# EAGLE design asomator4 (EAGLE 7.7.0)
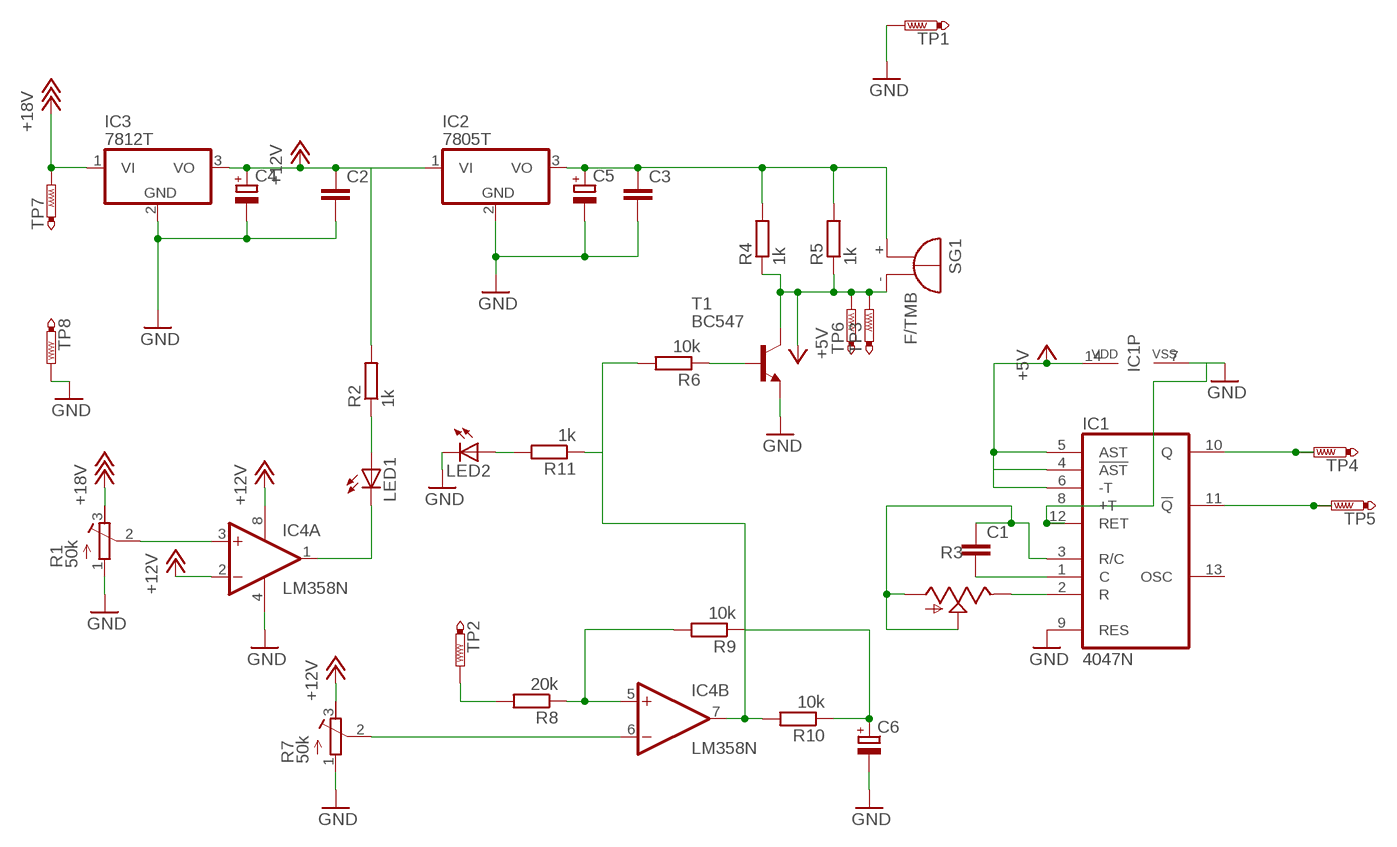
[diagram p0: schematic, sheet 1]

## Parts
C1  C-EU025-030X050  [C025-030X050]
C2  C-EU025-030X050  [C025-030X050]
C3  C-EU025-030X050  [C025-030X050]
C4  CPOL-EUE2.5-6  [E2,5-6]
C5  CPOL-EUE2.5-6  [E2,5-6]
C6  CPOL-EUE2.5-6  [E2,5-6]
IC1  4047N  [DIL14]
IC2  7805T  [TO220H]
IC3  7812T  [TO220H]
IC4  LM358N  [DIL08]
LED1  LED5MM  [LED5MM]
LED2  LED5MM  [LED5MM]
R1  50k  R-TRIMM64W  [RTRIM64W]
R2  1k  R-EU_0207/10  [0207/10]
R3  TRIM_US-CA9V  [CA9V]
R4  1k  R-EU_0207/10  [0207/10]
R5  1k  R-EU_0207/10  [0207/10]
R6  10k  R-EU_0207/10  [0207/10]
R7  50k  R-TRIMM64W  [RTRIM64W]
R8  20k  R-EU_0207/10  [0207/10]
R9  10k  R-EU_0207/10  [0207/10]
R10  10k  R-EU_0207/10  [0207/10]
R11  1k  R-EU_0207/10  [0207/10]
SG1  F/TMB  [F/TMB]
T1  BC547  [TO92]
TP1  PTR1PAD1-13Y  [P1-13Y]
TP2  PTR1PAD1-13Y  [P1-13Y]
TP3  PTR1PAD1-13Y  [P1-13Y]
TP4  PTR1PAD1-13Y  [P1-13Y]
TP5  PTR1PAD1-13Y  [P1-13Y]
TP6  PTR1PAD1-13Y  [P1-13Y]
TP7  PTR1PAD1-13Y  [P1-13Y]
TP8  PTR1PAD1-13Y  [P1-13Y]

## Nets
+5V: IC1.4(!AST) IC1.5(AST) IC1.6(-T) IC1.14(VDD) R4.1 R5.1 SG1.- T1.3(C) TP3.TP TP6.TP
+12V: C2.1 C4.+ IC2.1(VI) IC3.3(VO) IC4.2(A:-IN) IC4.8(P:V+) R2.2 R7.3(E)
+18V: IC3.1(VI) R1.3(E) TP7.TP
GND: C2.2 C3.2 C4.- C5.- C6.- IC1.7(VSS) IC1.8(+T) IC1.9(RES) IC1.12(RET) IC2.2(GND) IC3.2(GND) IC4.4(P:V-) LED2.K(C) R1.1(A) R7.1(A) T1.1(E) TP1.TP TP8.TP
N$1: IC1.10(Q) TP4.TP
N$2: LED1.A R2.1
N$3: IC1.11(!Q) TP5.TP
N$4: IC4.1(A:OUT) LED1.K(C)
N$5: IC4.3(A:+IN) R1.2(S)
N$6: IC4.7(B:OUT) R6.2 R10.2 R11.1
N$7: IC1.2(R) R3.E
N$8: C1.2 IC1.1(C)
N$9: C1.1 IC1.3(R/C) R3.A R3.S
N$10: C3.1 C5.+ IC2.3(VO) R4.2 R5.2 SG1.+
N$11: LED2.A R11.2
N$12: R8.2 TP2.TP
N$13: IC4.5(B:+IN) R8.1 R9.2
N$14: C6.+ R9.1 R10.1
N$15: IC4.6(B:-IN) R7.2(S)
N$18: R6.1 T1.2(B)
Unconnected: IC1.13(OSC)

## Library data of the parts
C1-C3 = rcl:C-EU: CAPACITOR, European symbol
C4-C6 = rcl:CPOL-EU: POLARIZED CAPACITOR, European symbol
IC1 = 40xx:4047: LP monostable/astable MULTIVIBRATOR
IC2 IC3 = linear:78*: Positive VOLTAGE REGULATOR Source: http://cache.national.com/ds/LM/LM78L05.pdf http://www.fairchildsemi.com/ds/LM/LM7805.pdf
IC4 = linear:LM358: OP AMP also LM158; LM258; LM2904 Source: http://cache.national.com/ds/LM/LM158.pdf
LED1 LED2 = led:LED: LED OSRAM: - CHIPLED LG R971, LG N971, LY N971, LG Q971, LY Q971, LO R971, LY R971 LH N974, LH R974 LS Q976, LO Q976, LY Q976 LO Q996 - Hyper CHIPLED LW Q18S LB Q993, LB Q99A, LB R99A - SideLED LS A670, LO A670, LY A670, LG A670, LP A670 LB A673, LV A673, LT A673, LW A673 LH A674 LY A675 LS A676, LA A676, LO A676, LY A676, LW A676 LS A679, LY A679, LG A679 - Hyper Micro SIDELED® LS Y876, LA Y876, LO Y876, LY Y876 LT Y87S - SmartLED LW L88C, LW L88S LB L89C, LB L89S, LG L890 LS L89K, LO L89K, LY L89K LS L896, LA L896, LO L896, LY L896 - TOPLED LS T670, LO T670, LY T670, LG T670, LP T670 LSG T670, LSP T670, LSY T670, LOP T670, LYG T670 LG T671, LOG T671, LSG T671 LB T673, LV T673, LT T673, LW T673 LH T674 LS T676, LA T676, LO T676, LY T676, LB T676, LH T676, LSB T676, LW T676 LB T67C, LV T67C, LT T67C, LS T67K, LO T67K, LY T67K, LW E67C LS E67B, LA E67B, LO E67B, LY E67B, LB E67C, LV E67C, LT E67C LW T67C LS T679, LY T679, LG T679 LS T770, LO T770, LY T770, LG T770, LP T770 LB T773, LV T773, LT T773, LW T773 LH T774 LS E675, LA E675, LY E675, LS T675 LS T776, LA T776, LO T776, LY T776, LB T776 LHGB T686 LT T68C, LB T68C - Hyper Mini TOPLED® LB M676 - Mini TOPLED Santana® LG M470 LS M47K, LO M47K, LY M47K Source: http://www.osram.convergy.de LUXEON: - LUMILED® LXK2-PW12-R00, LXK2-PW12-S00, LXK2-PW14-U00, LXK2-PW14-V00 LXK2-PM12-R00, LXK2-PM12-S00, LXK2-PM14-U00 LXK2-PE12-Q00, LXK2-PE12-R00, LXK2-PE12-S00, LXK2-PE14-T00, LXK2-PE14-U00 LXK2-PB12-K00, LXK2-PB12-L00, LXK2-PB12-M00, LXK2-PB14-N00, LXK2-PB14-P00, LXK2-PB14-Q00 LXK2-PR12-L00, LXK2-PR12-M00, LXK2-PR14-Q00, LXK2-PR14-R00 LXK2-PD12-Q00, LXK2-PD12-R00, LXK2-PD12-S00 LXK2-PH12-R00, LXK2-PH12-S00 LXK2-PL12-P00, LXK2-PL12-Q00, LXK2-PL12-R00 Source: www.luxeon.com KINGBRIGHT: KA-3528ASYC Source: www.kingbright.com
R1 R7 = rcl:R-TRIMM: Trimm resistor
R2 R4-R6 R8-R11 = rcl:R-EU_: RESISTOR, European symbol
R3 = pot:TRIM_US-: POTENTIOMETER
SG1 = buzzer:F/TMB: BUZZER Source: Buerklin; OC_FARNELL: unknown; OC_NEWARK: unknown
T1 = transistor:BC547: NPN TRANSISTOR
TP1-TP8 = testpad:PTR1: TEST PIN

## Board
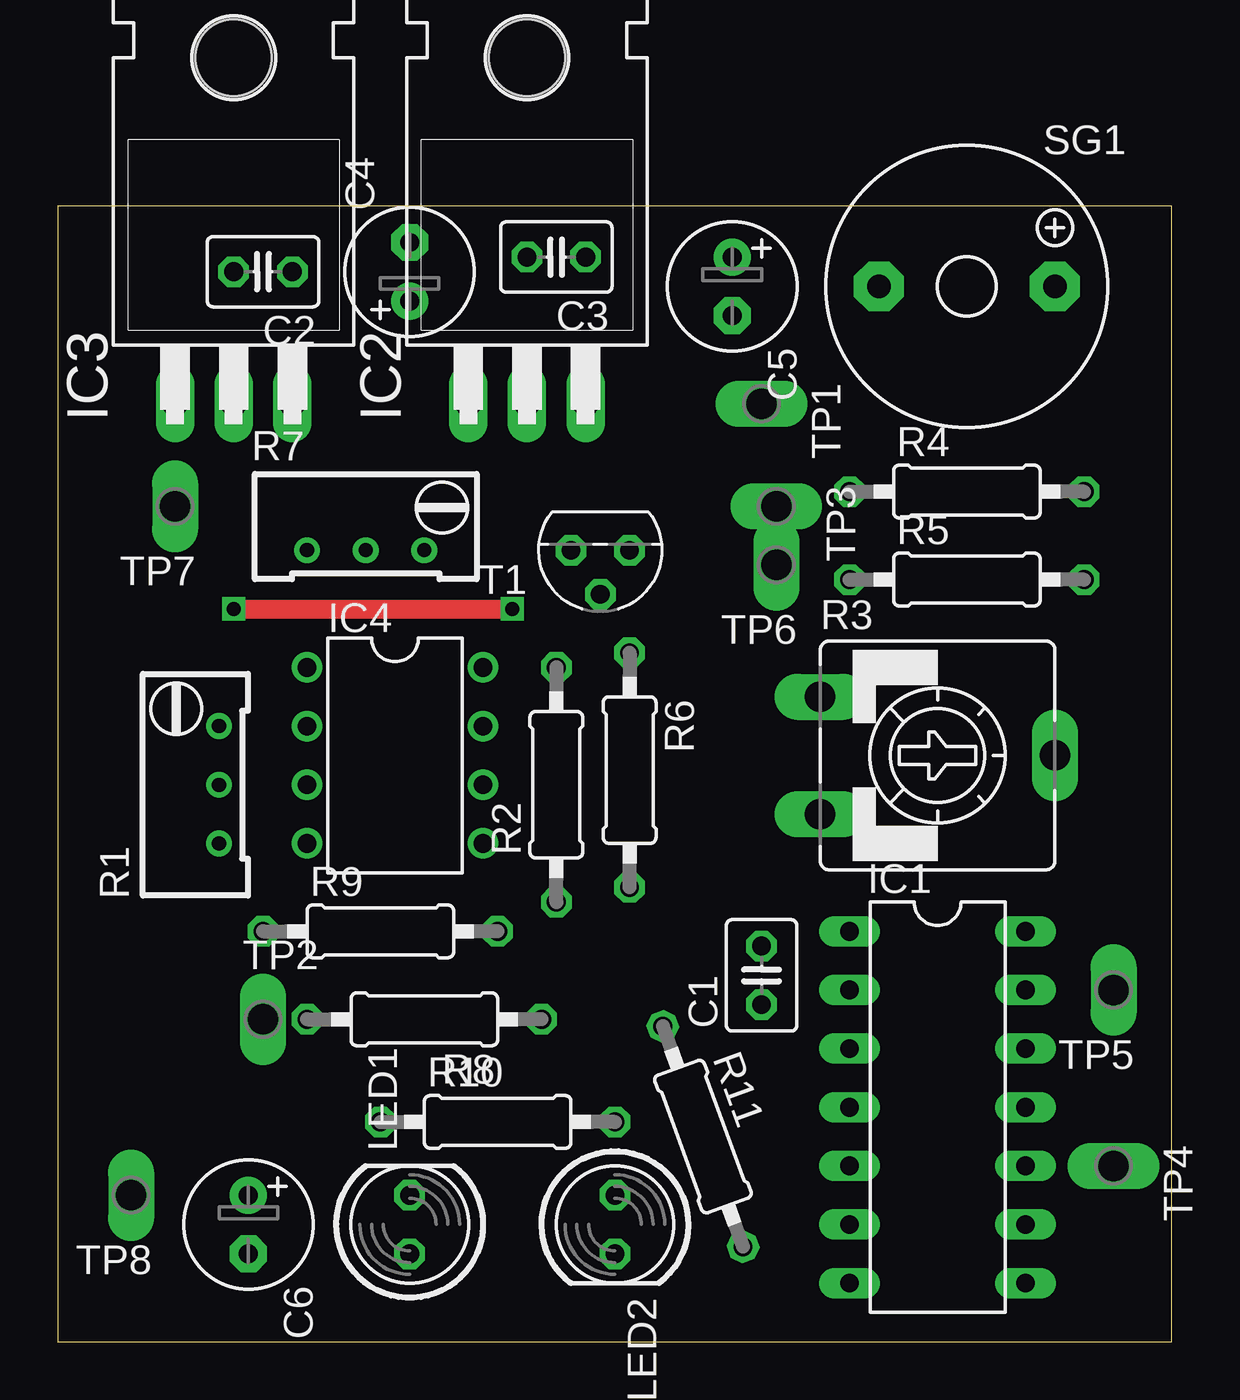
[diagram p1: board, top side]
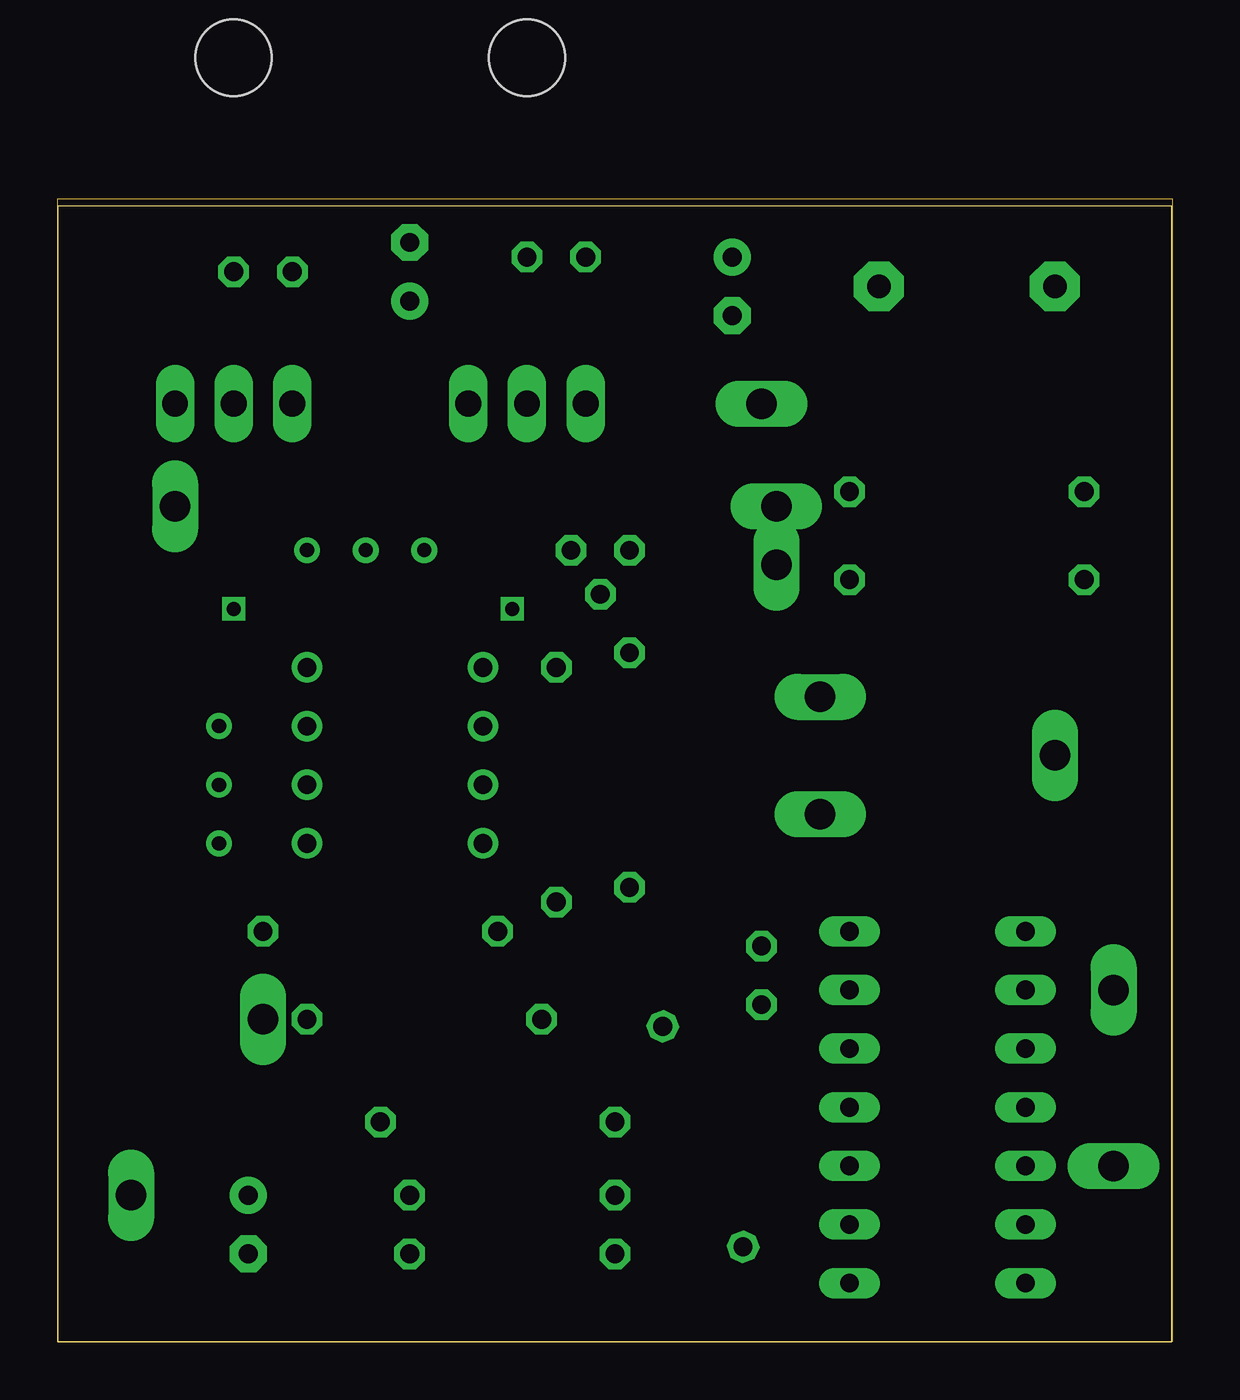
[diagram p2: board, inner layer Route2]
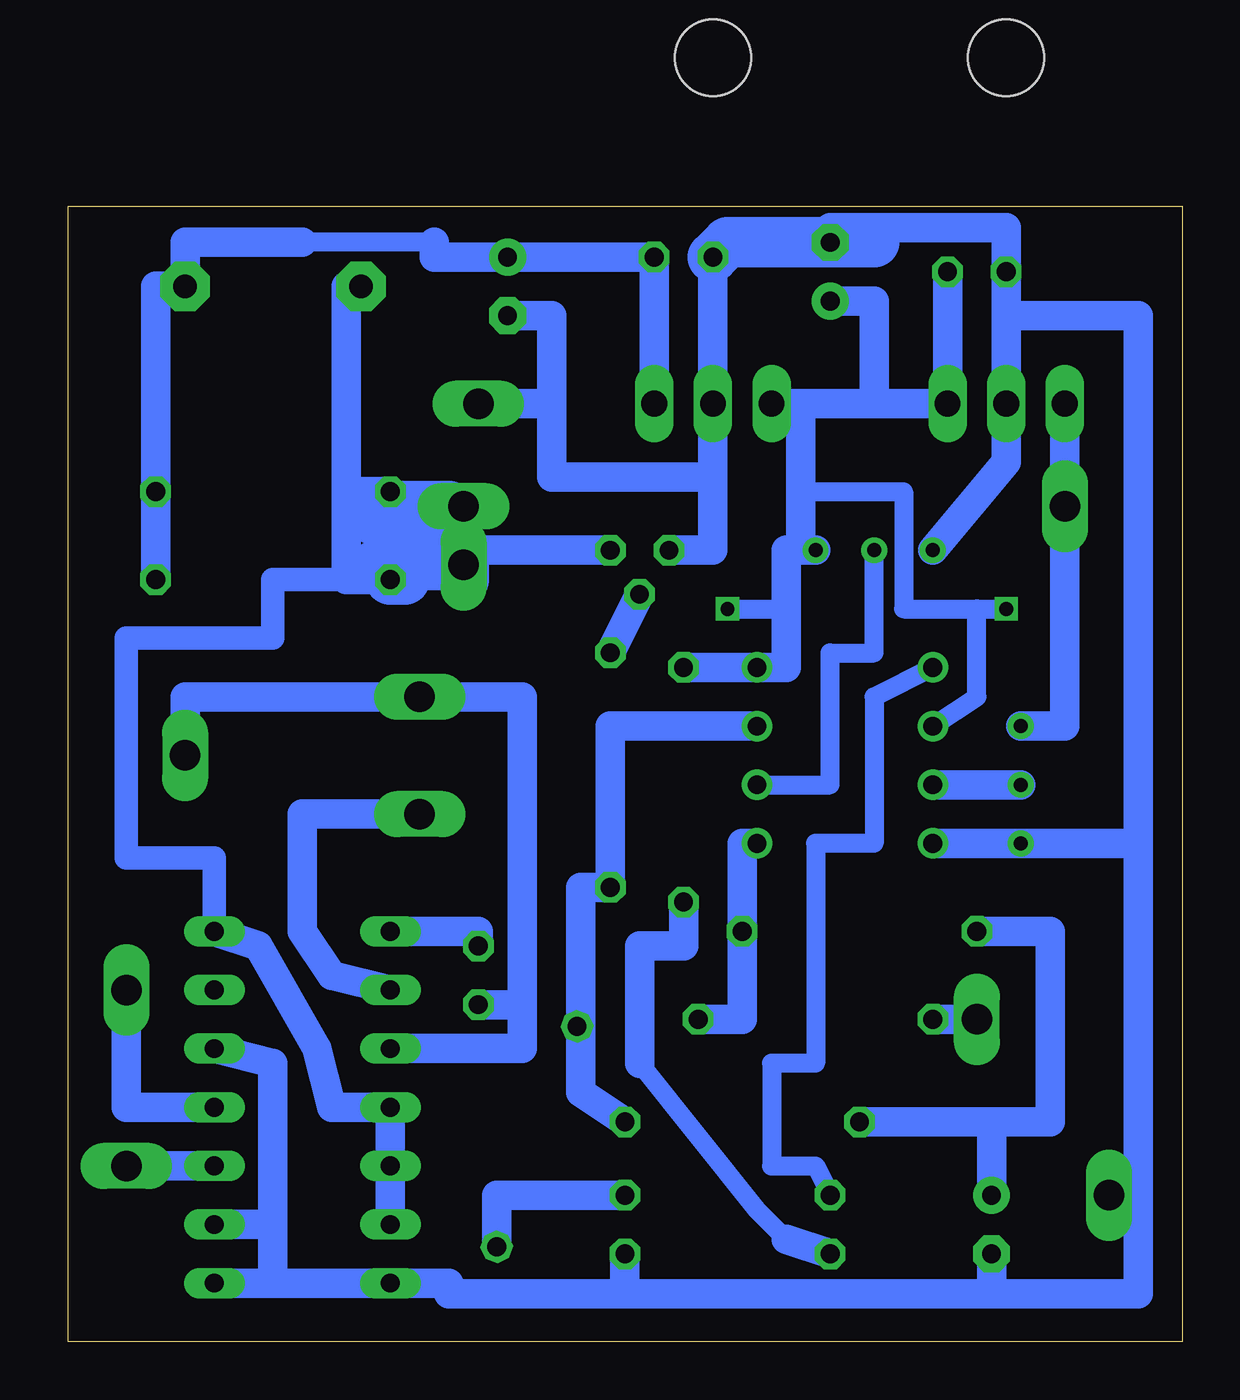
[diagram p3: board, bottom side, seen from below]

Size 48.24 x 49.2 mm. Coordinates in mm from the lower left corner, seen from the top.
Outline: 0,0 48.24,0 48.24,49.2 0,49.2 0,0
Copper layers (1*2*16): Top 0.035mm / dielectric 1.5mm / Route2 0.035mm / dielectric 0.15mm / Bottom 0.035mm
Design rules "default *": minimum track width 32mil, minimum drill 24mil, track to track 8mil, track to pad 8mil, pad to pad 8mil, via to via 8mil, smd to smd 8mil, copper to edge 40mil, drill to drill 8mil, minimum pad ring 10mil, minimum via ring 8mil, stop-mask expansion 4mil, vias tented up to drill 0mil, thermal gap 10mil

### Footprints (pad centres in the part's own frame; a part is rotated, then mirrored left to right if it is on the bottom)
C025-030X050 = drill 0.813 octagon: 1 -1.27,0; 2 1.27,0
E2,5-6 = drill 0.813 pad 1.6: + -1.27,0 | drill 0.813 pad 1.6 octagon: - 1.27,0
DIL14 = drill 0.813 long: 1 -7.62,-3.81; 2 -5.08,-3.81; 3 -2.54,-3.81; 4 0,-3.81; 5 2.54,-3.81; 6 5.08,-3.81; 7 7.62,-3.81; 8 7.62,3.81; 9 5.08,3.81; 10 2.54,3.81; 11 0,3.81; 12 -2.54,3.81; 13 -5.08,3.81; 14 -7.62,3.81
TO220H = drill 1.118 long: 1 -2.54,-10.16; 2 0,-10.16; 3 2.54,-10.16 | hole 3.302: 0,4.826
DIL08 = drill 0.813 pad 1.27: 1 -3.81,-3.81; 2 -1.27,-3.81; 3 1.27,-3.81; 4 3.81,-3.81; 5 3.81,3.81; 6 1.27,3.81; 7 -1.27,3.81; 8 -3.81,3.81
LED5MM = drill 0.813 octagon: A -1.27,0; K 1.27,0
RTRIM64W = drill 0.61: 1 1.27,-2.54; 2 1.27,0; 3 1.27,2.54
0207/10 = drill 0.813 octagon: 1 -5.08,0; 2 5.08,0
CA9V = drill 1.321 long: A -2.54,-5.08; E 2.54,-5.08; S 0,5.08
F/TMB = drill 1.016 pad 2.159 octagon: + 3.81,0; - -3.81,0
TO92 = drill 0.813 octagon: 1 1.27,0; 2 0,1.905; 3 -1.27,0
P1-13Y = drill 1.321 pad 1.905 long: TP 0,0

### Placement (x,y rotation side)
C1  30.48,15.88 90 top
C2  8.89,46.35 180 top
C3  21.59,46.99 180 top
C4  15.24,46.35 90 top
C5  29.21,45.72 270 top
C6  8.26,5.08 270 top
IC1  38.1,10.16 270 top
IC2  20.32,50.8 0 top
IC3  7.62,50.8 0 top
IC4  14.61,25.4 270 top
LED1  15.24,5.08 90 top
LED2  24.13,5.08 270 top
R1  5.71,24.13 0 top
R2  21.59,24.13 90 top
R3  38.1,25.4 270 top
R4  39.37,36.83 0 top
R5  39.37,33.02 0 top
R6  24.77,24.77 270 top
R7  13.34,35.56 270 top
R8  15.88,13.97 180 top
R9  13.97,17.78 0 top
R10  19.05,9.53 0 top
R11  27.94,8.89 290 top
SG1  39.37,45.72 0 top
T1  23.5,34.29 180 top
TP1  30.48,40.64 270 top
TP2  8.89,13.97 0 top
TP3  31.11,36.2 270 top
TP4  45.72,7.62 270 top
TP5  45.72,15.24 180 top
TP6  31.11,33.66 180 top
TP7  5.08,36.2 180 top
TP8  3.17,6.35 180 top

### Tracks (layer width: path | path; a pad name or v marks a point on that pad's centre or on a via)
+5V
  Bottom 1.016: 36.2,33.02 39.37,33.02 39.37,30.48 45.72,30.48 45.72,20.95 41.91,20.95 IC1.14
  Bottom 1.27: SG1.- 36.2,45.72 36.2,36.83 | R4.1 36.2,36.83 | 36.2,36.83 36.2,33.02 R5.1 | TP6.TP 31.11,34.29 T1.3 | 34.92,35.56 R4.1 | R4.1 33.66,36.2 | 31.75,36.2 TP3.TP | IC1.6 IC1.5 IC1.4 36.83,10.16 37.47,12.7 40.01,17.14 IC1.14
  Bottom 2.184: R5.1 33.66,33.02 34.92,33.66 TP6.TP | TP6.TP 31.11,33.02 | TP6.TP 34.92,35.56 | 33.66,36.2 31.75,36.2
+12V  (via drill 0.6)
  Top 0.813: v7.62,31.75 v19.68,31.75
  Bottom 0.813: IC4.2 8.89,27.94 8.89,31.75 | 8.89,31.75 v7.62,31.75 | v19.68,31.75 17.14,31.75 | 16.51,36.83 12.06,36.83 12.06,31.75 8.89,31.75
  Bottom 1.27: C2.1 IC3.3 13.34,40.64 | 13.34,40.64 IC2.1 16.51,40.64 16.51,36.83 16.51,34.29 | 13.34,40.64 13.34,45.09 C4.+ | R2.2 IC4.8 17.14,29.21 17.14,31.75 17.14,34.29 16.51,34.29 | 16.51,34.29 R7.3
+18V
  Bottom 1.27: IC3.1 TP7.TP 5.08,26.67 R1.3
GND
  Bottom 1.27: C3.2 IC2.2 20.32,37.47 | C5.- 27.3,44.45 27.3,40.64 | 27.3,40.64 27.3,37.47 20.32,37.47 | T1.1 20.32,34.29 20.32,37.47 | IC1.12 39.37,12.06 39.37,5.08 | IC1.9 39.37,5.08 | 39.37,5.08 39.37,2.54 | 39.37,2.54 IC1.8 | 39.37,2.54 IC1.7 31.75,2.54 31.75,2.07 24.13,2.07 | 16.51,47.62 C4.- 15.24,48.26 7.62,48.26 C2.2 7.62,44.45 | 7.62,44.45 IC3.2 7.62,38.1 R7.1 | R1.1 IC4.4 1.91,21.59 | 8.26,2.07 1.91,2.07 1.91,6.35 | 1.91,6.35 1.91,21.59 | 1.91,21.59 1.91,44.45 7.62,44.45 | C6.- 8.26,2.07 | 8.26,2.07 24.13,2.07 | LED2.K 24.13,2.07 | TP8.TP 1.91,6.35 | TP1.TP 27.3,40.64
  Bottom 2.184: 13.34,47.62 16.51,47.62 19.68,47.62 C3.2
N$1
  Bottom 1.27: TP4.TP IC1.10
N$2
  Bottom 0.813: 23.5,12.06 18.41,5.71 17.14,4.45
  Bottom 1.27: R2.1 21.59,17.14 23.5,17.14 23.5,12.06 | 17.14,4.45 LED1.A
N$3
  Bottom 1.27: TP5.TP 45.72,10.16 IC1.11
N$4
  Bottom 0.813: IC4.1 13.34,27.94 13.34,21.59 15.88,21.59 15.88,12.06 17.78,12.06 17.78,7.62 15.88,7.62 LED1.K
N$5
  Bottom 1.27: R1.2 IC4.3
N$6
  Bottom 1.27: IC4.7 24.77,26.67 R6.2 26.04,19.68 26.04,13.66 | R10.2 26.04,10.79 26.04,12.06 26.04,13.66 | R11.1 26.04,13.66
N$7
  Bottom 1.27: IC1.2 36.83,15.88 38.1,17.78 38.1,22.86 R3.E
N$8
  Bottom 1.27: C1.2 30.48,17.78 IC1.1
N$9
  Bottom 1.27: R3.S 43.18,27.94 R3.A 28.57,27.94 28.57,14.61 | 28.57,14.61 C1.1 | IC1.3 28.57,12.7 28.57,14.61
N$10
  Bottom 0.813: 32.38,47.62 38.1,47.62
  Bottom 1.27: IC2.3 C3.1 C5.+ 32.38,46.99 32.38,47.62 | 38.1,47.62 43.18,47.62 SG1.+ 44.45,45.72 R4.2 R5.2
N$11
  Bottom 1.27: LED2.A 29.68,6.35 R11.2
N$12
  Bottom 1.27: R8.2 TP2.TP
N$13
  Bottom 1.27: IC4.5 19.05,21.59 R9.2 19.05,13.97 R8.1
N$14
  Bottom 1.27: R9.1 5.71,17.78 5.71,9.53 8.26,9.53 | 8.26,9.53 R10.1 | C6.+ 8.26,9.53
N$15
  Bottom 0.813: IC4.6 15.24,24.13 15.24,29.84 13.34,29.84 R7.2
N$16
  Route2 0: 0,0 0,49.53 48.26,49.53 48.26,0 0,0
N$18
  Bottom 1.27: T1.2 R6.1